# EAGLE design usb card (EAGLE 9.0.0)

## Sheet 1 of 5
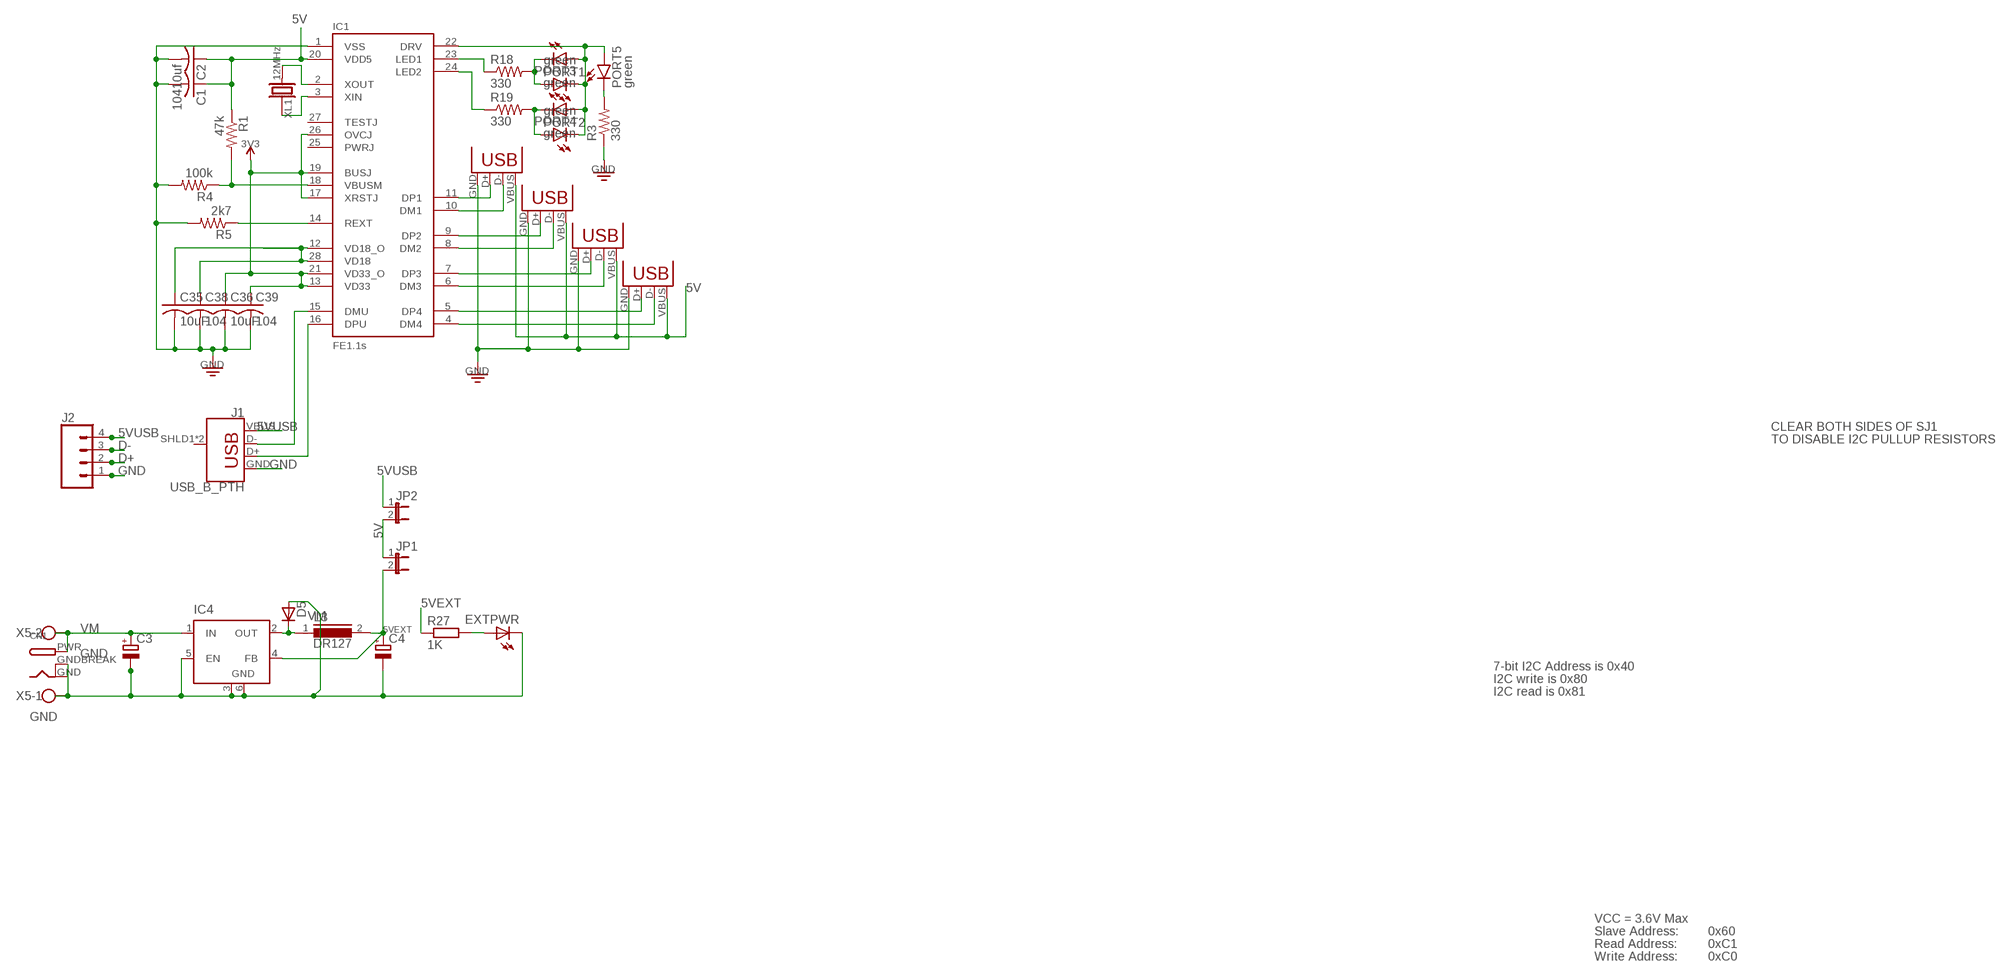
[diagram p0: schematic, sheet 1]

### Parts
C1  104  C-USC1206  [C1206]
C2  10uf  C-USC1206  [C1206]
C3  CPOL-EUE3.5-8  [E3,5-8]
C4  CPOL-EUE3.5-8  [E3,5-8]
C35  10uF  C-USC1206  [C1206]
C36  10uF  C-USC1206  [C1206]
C38  104  C-USC1206  [C1206]
C39  104  C-USC1206  [C1206]
CN1  DCBARRELPTH  [DCJACK_2MM_PTH]
D5  D-SOD-80  [SOD80]
EXTPWR  LEDCHIPLED_1206  [CHIPLED_1206]
IC1  FE1.1S  [FE1.1S_SSOP-28]
IC4  LM2596S  [TO263-5]
J1  USB_B_PTH  [USB-B-PTH]
J2  CONN_04  [1X04]
JP1  JP1E  [JP1]
JP2  JP1E  [JP1]
L3  DR127  [DR127]
PORT1  green  LED1206  [LED-1206]
PORT2  green  LED1206  [LED-1206]
PORT3  green  LED1206  [LED-1206]
PORT4  green  LED1206  [LED-1206]
PORT5  green  LED1206  [LED-1206]
R1  47k  R-US_R1206  [R1206]
R3  330  R-US_R1206  [R1206]
R4  100k  R-US_R1206  [R1206]
R5  2k7  R-US_R1206  [R1206]
R18  330  R-US_R1206  [R1206]
R19  330  R-US_R1206  [R1206]
R27  1K  R-EU_M1206  [M1206]
USB2  USBA-PTH  [USB-A-F-PTH]
USB3  USBA-PTH  [USB-A-F-PTH]
USB4  USBA-PTH  [USB-A-F-PTH]
USB5  USBA-PTH  [USB-A-F-PTH]
X5  W237-102  [W237-102]
XL1  12MHz  CRYSTALHC49S  [HC49S]

### Nets
3V3: C36.1 C39.1 IC1.13(VD33) IC1.17(XRSTJ) IC1.19(BUSJ) IC1.21(VD33_O) IC1.26(OVCJ)
5V: C1.1 C2.1 IC1.20(VDD5) JP1.1 JP2.2 R1.1 USB2.VBUS USB3.VBUS USB4.VBUS USB5.VBUS ; also sheet 2,3,4,5
5VEXT: C4.+ IC4.4(FB) JP1.2 L3.2 R27.1
5VUSB: J1.VBUS J2.4 JP2.1
D+: IC1.16(DPU) J1.D+ J2.2
D-: IC1.15(DMU) J1.D- J2.3
DM1: IC1.10(DM1) USB5.D- ; also sheet 2
DM2: IC1.8(DM2) USB4.D- ; also sheet 3
DM3: IC1.6(DM3) USB3.D- ; also sheet 4
DM4: IC1.4(DM4) USB2.D- ; also sheet 5
DP1: IC1.11(DP1) USB5.D+ ; also sheet 2
DP2: IC1.9(DP2) USB4.D+ ; also sheet 3
DP3: IC1.7(DP3) USB3.D+ ; also sheet 4
DP4: IC1.5(DP4) USB2.D+ ; also sheet 5
GND: C1.2 C2.2 C3.- C4.- C35.2 C36.2 C38.2 C39.2 CN1.GND CN1.GNDBREAK D5.2(A) EXTPWR.C IC1.1(VSS) IC4.3(GND) IC4.5(EN) IC4.6(GND) J1.GND J2.1 R3.1 R4.2 R5.2 USB2.GND USB3.GND USB4.GND USB5.GND X5.1 ; also sheet 2,3,4,5
N$1: IC1.14(REXT) R5.1
N$6: PORT2.C PORT4.A R19.2
N$7: IC1.2(XOUT) XL1.2
N$8: C35.1 C38.1 IC1.12(VD18_O) IC1.28(VD18)
N$9: IC1.3(XIN) XL1.1
N$13: IC1.18(VBUSM) R1.2 R4.1
N$20: PORT1.C PORT3.A R18.2
N$22: PORT5.C R3.2
N$23: IC1.23(LED1) R18.1
N$24: IC1.24(LED2) R19.1
N$25: IC1.22(DRV) PORT1.A PORT2.A PORT3.C PORT4.C PORT5.A
N$36: D5.1(C) IC4.2(OUT) L3.1
N$37: EXTPWR.A R27.2
VM: C3.+ CN1.PWR IC4.1(IN) X5.2
Unconnected: IC1.25(PWRJ) IC1.27(TESTJ) J1.SHLD1(SHIELD) J1.SHLD2(SHIELD)

### Notes on the sheet
- CLEAR BOTH SIDES OF SJ1
- TO DISABLE I2C PULLUP RESISTORS
- 7-bit I2C Address is 0x40
- I2C write is 0x80
- I2C read is 0x81
- VCC = 3.6V Max
- Slave Address: | 0x60
- Read Address: | 0xC1
- Write Address: | 0xC0

## Sheet 2 of 5
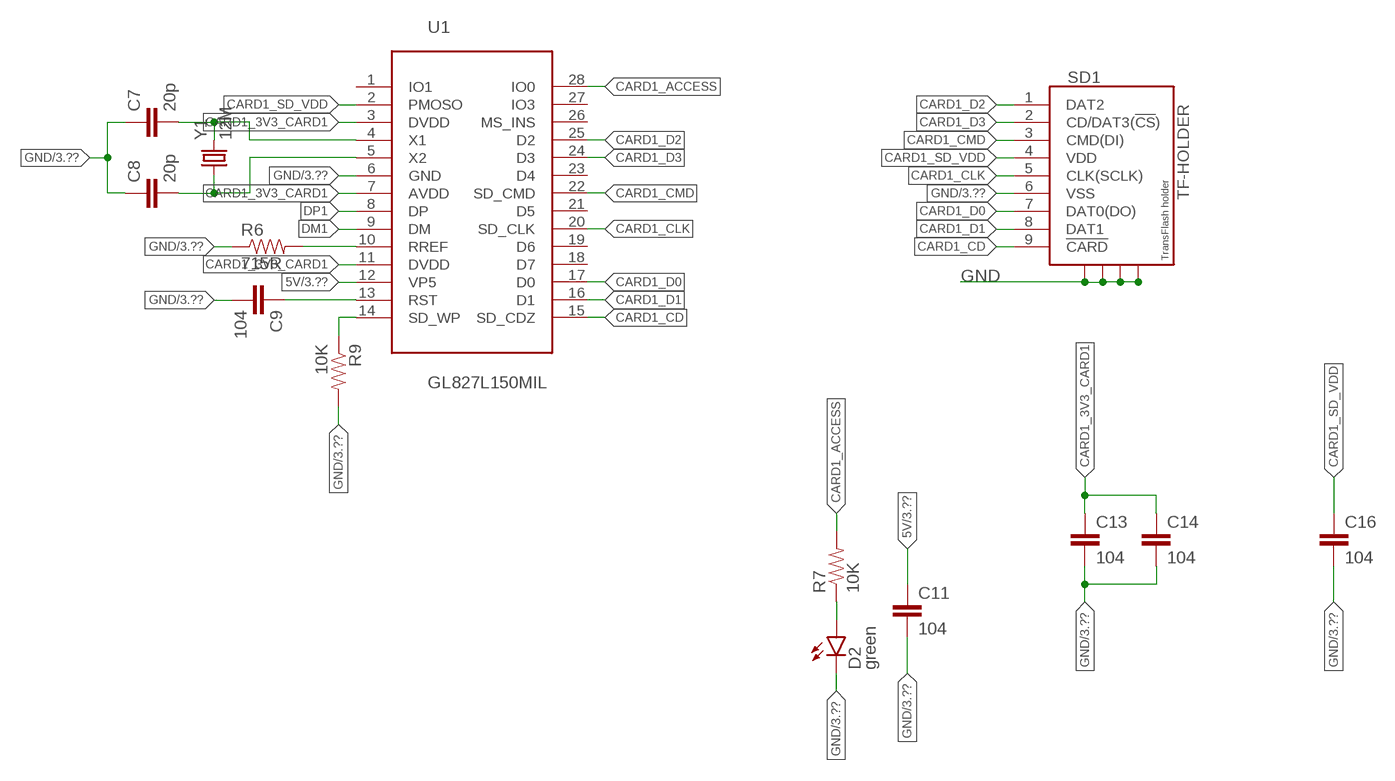
[diagram p1: schematic, sheet 2]

### Parts
C7  20p  CAP1206  [1206]
C8  20p  CAP1206  [1206]
C9  104  CAP1206  [1206]
C11  104  CAP1206  [1206]
C13  104  CAP1206  [1206]
C14  104  CAP1206  [1206]
C16  104  CAP1206  [1206]
D2  green  LED1206  [LED-1206]
R6  715R  RESISTOR1206  [1206]
R7  10K  RESISTOR1206  [1206]
R9  10K  RESISTOR1206  [1206]
SD1  TF-HOLDER  [TF-PULL]
U1  GL827L150MIL  [SSOP28-39]
Y1  12M  CRYSTAL2HC49US  [HC49US]

### Nets
5V: C11.1 U1.12(VP5) ; also sheet 1,3,4,5
CARD1_3V3_CARD1: C13.1 C14.1 U1.3(DVDD) U1.7(AVDD) U1.11(DVDD)
CARD1_ACCESS: R7.2 U1.28(IO0)
CARD1_CD: SD1.9(!CARD) U1.15(SD_CDZ)
CARD1_CLK: SD1.5(CLK(SCLK)) U1.20(SD_CLK)
CARD1_CMD: SD1.3(CMD(DI)) U1.22(SD_CMD)
CARD1_D0: SD1.7(DAT0(DO)) U1.17(D0)
CARD1_D1: SD1.8(DAT1) U1.16(D1)
CARD1_D2: SD1.1(DAT2) U1.25(D2)
CARD1_D3: SD1.2(CD/DAT3(!CS!)) U1.24(D3)
CARD1_SD_VDD: C16.1 SD1.4(VDD) U1.2(PMOSO)
DM1: U1.9(DM) ; also sheet 1
DP1: U1.8(DP) ; also sheet 1
GND: C7.1 C8.1 C9.2 C11.2 C13.2 C14.2 C16.2 D2.C R6.1 R9.2 SD1.6(VSS) SD1.S1 SD1.S2 SD1.S3 SD1.S4 U1.6(GND) ; also sheet 1,3,4,5
N$2: C7.2 U1.4(X1) Y1.2
N$5: C8.2 U1.5(X2) Y1.1
N$10: R6.2 U1.10(RREF)
N$21: C9.1 U1.13(RST)
N$26: D2.A R7.1
N$28: R9.1 U1.14(SD_WP)
Unconnected: U1.1(IO1) U1.18(D7) U1.19(D6) U1.21(D5) U1.23(D4) U1.26(MS_INS) U1.27(IO3)

## Sheet 3 of 5
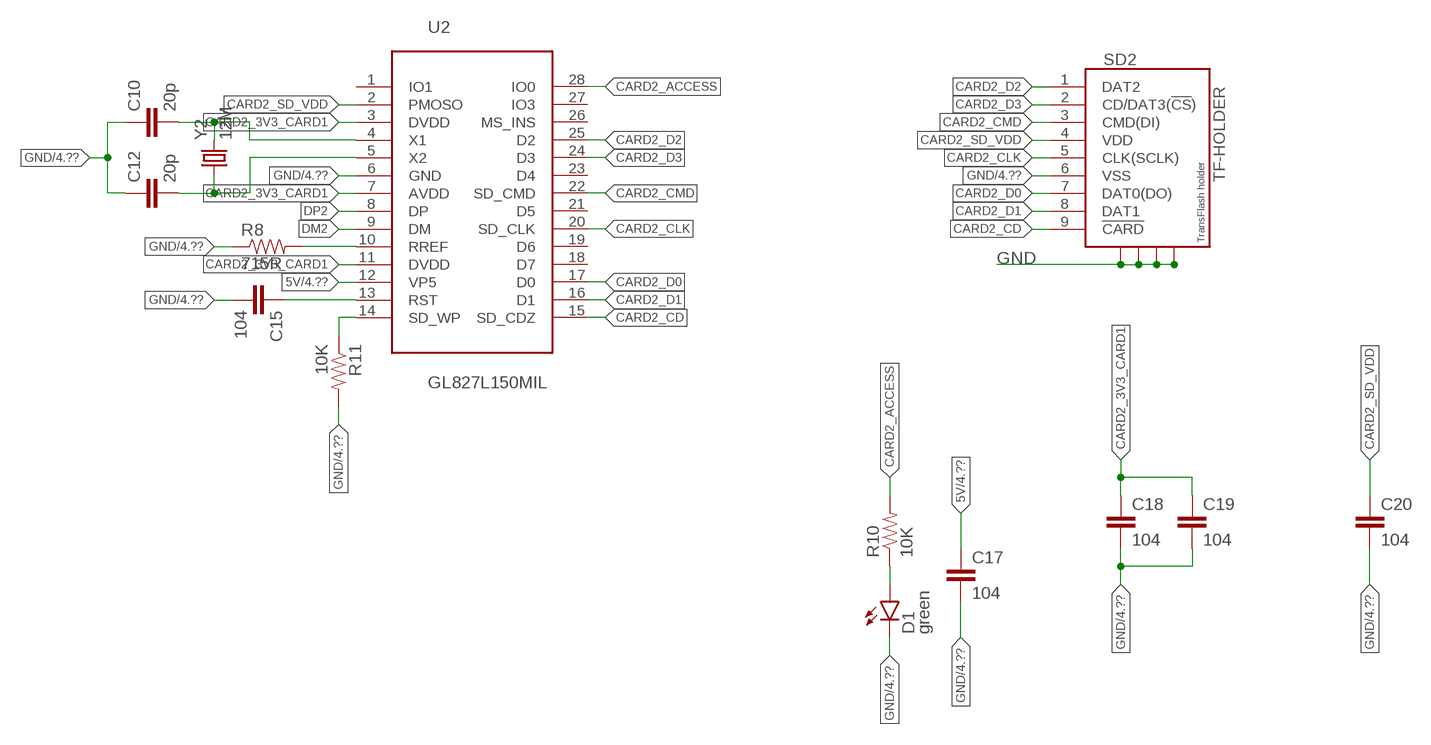
[diagram p2: schematic, sheet 3]

### Parts
C10  20p  CAP1206  [1206]
C12  20p  CAP1206  [1206]
C15  104  CAP1206  [1206]
C17  104  CAP1206  [1206]
C18  104  CAP1206  [1206]
C19  104  CAP1206  [1206]
C20  104  CAP1206  [1206]
D1  green  LED1206  [LED-1206]
R8  715R  RESISTOR1206  [1206]
R10  10K  RESISTOR1206  [1206]
R11  10K  RESISTOR1206  [1206]
SD2  TF-HOLDER  [TF-PULL]
U2  GL827L150MIL  [SSOP28-39]
Y2  12M  CRYSTAL2HC49US  [HC49US]

### Nets
5V: C17.1 U2.12(VP5) ; also sheet 1,2,4,5
CARD2_3V3_CARD1: C18.1 C19.1 U2.3(DVDD) U2.7(AVDD) U2.11(DVDD)
CARD2_ACCESS: R10.2 U2.28(IO0)
CARD2_CD: SD2.9(!CARD) U2.15(SD_CDZ)
CARD2_CLK: SD2.5(CLK(SCLK)) U2.20(SD_CLK)
CARD2_CMD: SD2.3(CMD(DI)) U2.22(SD_CMD)
CARD2_D0: SD2.7(DAT0(DO)) U2.17(D0)
CARD2_D1: SD2.8(DAT1) U2.16(D1)
CARD2_D2: SD2.1(DAT2) U2.25(D2)
CARD2_D3: SD2.2(CD/DAT3(!CS!)) U2.24(D3)
CARD2_SD_VDD: C20.1 SD2.4(VDD) U2.2(PMOSO)
DM2: U2.9(DM) ; also sheet 1
DP2: U2.8(DP) ; also sheet 1
GND: C10.1 C12.1 C15.2 C17.2 C18.2 C19.2 C20.2 D1.C R8.1 R11.2 SD2.6(VSS) SD2.S1 SD2.S2 SD2.S3 SD2.S4 U2.6(GND) ; also sheet 1,2,4,5
N$3: C10.2 U2.4(X1) Y2.2
N$4: C12.2 U2.5(X2) Y2.1
N$11: R8.2 U2.10(RREF)
N$12: C15.1 U2.13(RST)
N$14: D1.A R10.1
N$15: R11.1 U2.14(SD_WP)
Unconnected: U2.1(IO1) U2.18(D7) U2.19(D6) U2.21(D5) U2.23(D4) U2.26(MS_INS) U2.27(IO3)

## Sheet 4 of 5
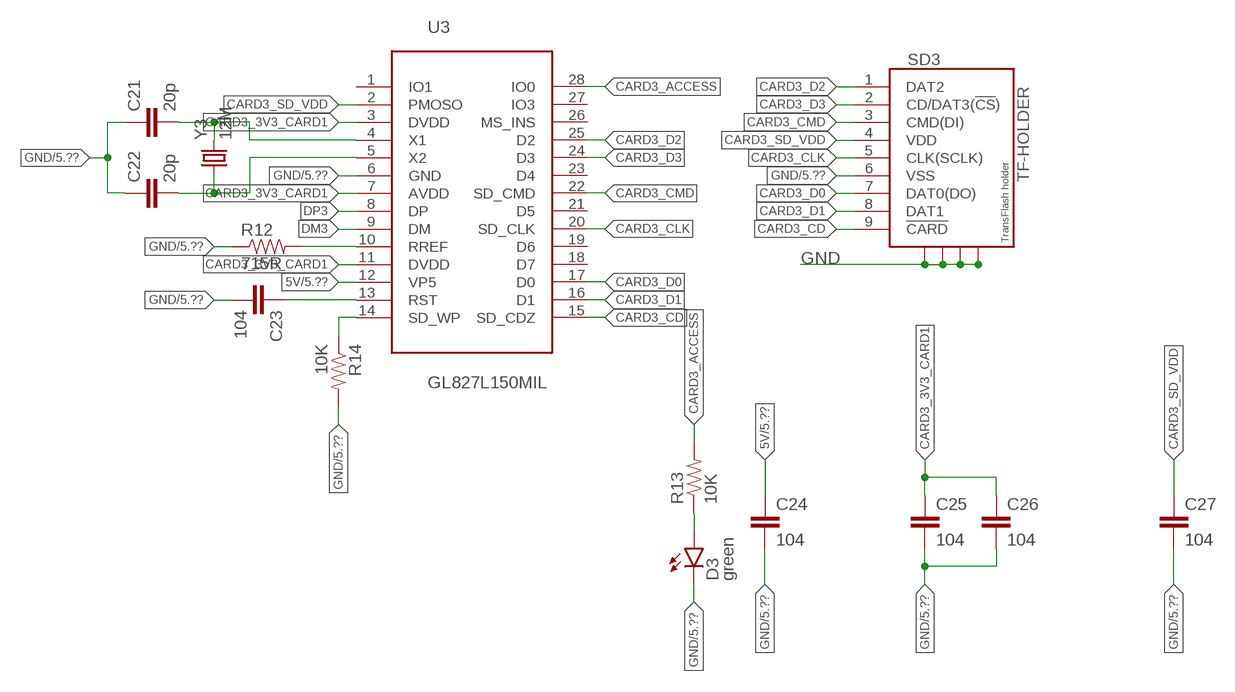
[diagram p3: schematic, sheet 4]

### Parts
C21  20p  CAP1206  [1206]
C22  20p  CAP1206  [1206]
C23  104  CAP1206  [1206]
C24  104  CAP1206  [1206]
C25  104  CAP1206  [1206]
C26  104  CAP1206  [1206]
C27  104  CAP1206  [1206]
D3  green  LED1206  [LED-1206]
R12  715R  RESISTOR1206  [1206]
R13  10K  RESISTOR1206  [1206]
R14  10K  RESISTOR1206  [1206]
SD3  TF-HOLDER  [TF-PULL]
U3  GL827L150MIL  [SSOP28-39]
Y3  12M  CRYSTAL2HC49US  [HC49US]

### Nets
5V: C24.1 U3.12(VP5) ; also sheet 1,2,3,5
CARD3_3V3_CARD1: C25.1 C26.1 U3.3(DVDD) U3.7(AVDD) U3.11(DVDD)
CARD3_ACCESS: R13.2 U3.28(IO0)
CARD3_CD: SD3.9(!CARD) U3.15(SD_CDZ)
CARD3_CLK: SD3.5(CLK(SCLK)) U3.20(SD_CLK)
CARD3_CMD: SD3.3(CMD(DI)) U3.22(SD_CMD)
CARD3_D0: SD3.7(DAT0(DO)) U3.17(D0)
CARD3_D1: SD3.8(DAT1) U3.16(D1)
CARD3_D2: SD3.1(DAT2) U3.25(D2)
CARD3_D3: SD3.2(CD/DAT3(!CS!)) U3.24(D3)
CARD3_SD_VDD: C27.1 SD3.4(VDD) U3.2(PMOSO)
DM3: U3.9(DM) ; also sheet 1
DP3: U3.8(DP) ; also sheet 1
GND: C21.1 C22.1 C23.2 C24.2 C25.2 C26.2 C27.2 D3.C R12.1 R14.2 SD3.6(VSS) SD3.S1 SD3.S2 SD3.S3 SD3.S4 U3.6(GND) ; also sheet 1,2,3,5
N$16: C21.2 U3.4(X1) Y3.2
N$17: C22.2 U3.5(X2) Y3.1
N$18: R12.2 U3.10(RREF)
N$19: C23.1 U3.13(RST)
N$27: D3.A R13.1
N$29: R14.1 U3.14(SD_WP)
Unconnected: U3.1(IO1) U3.18(D7) U3.19(D6) U3.21(D5) U3.23(D4) U3.26(MS_INS) U3.27(IO3)

## Sheet 5 of 5
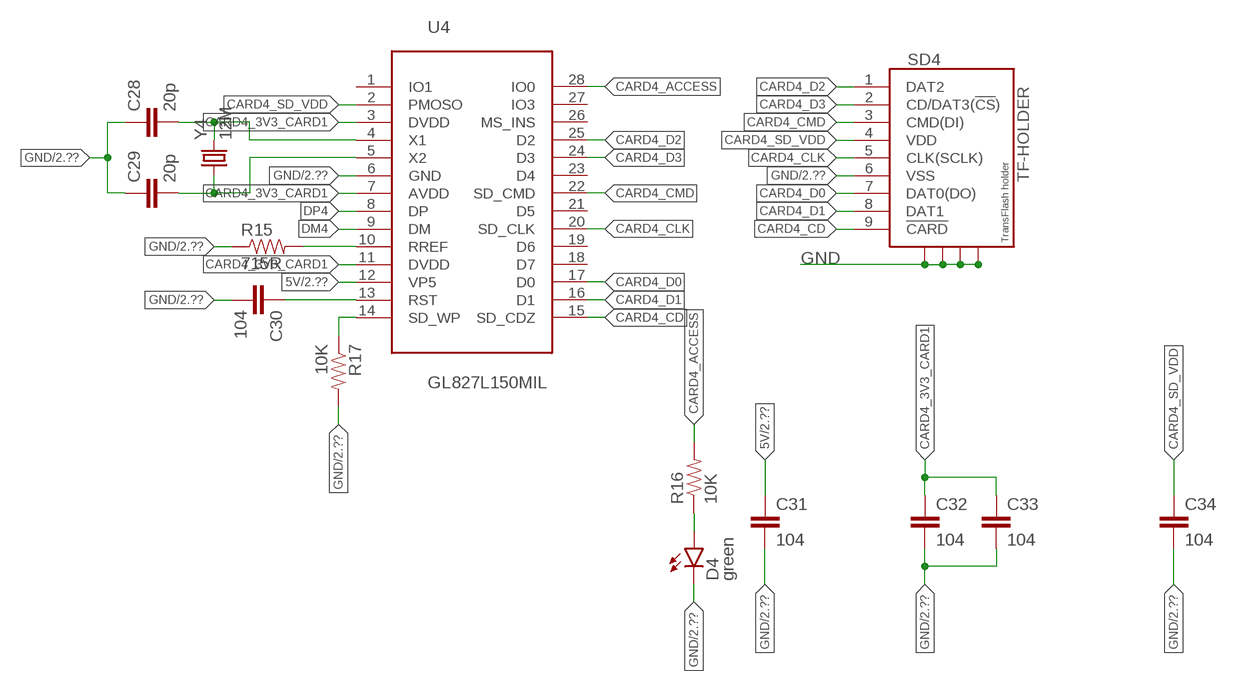
[diagram p4: schematic, sheet 5]

### Parts
C28  20p  CAP1206  [1206]
C29  20p  CAP1206  [1206]
C30  104  CAP1206  [1206]
C31  104  CAP1206  [1206]
C32  104  CAP1206  [1206]
C33  104  CAP1206  [1206]
C34  104  CAP1206  [1206]
D4  green  LED1206  [LED-1206]
R15  715R  RESISTOR1206  [1206]
R16  10K  RESISTOR1206  [1206]
R17  10K  RESISTOR1206  [1206]
SD4  TF-HOLDER  [TF-PULL]
U4  GL827L150MIL  [SSOP28-39]
Y4  12M  CRYSTAL2HC49US  [HC49US]

### Nets
5V: C31.1 U4.12(VP5) ; also sheet 1,2,3,4
CARD4_3V3_CARD1: C32.1 C33.1 U4.3(DVDD) U4.7(AVDD) U4.11(DVDD)
CARD4_ACCESS: R16.2 U4.28(IO0)
CARD4_CD: SD4.9(!CARD) U4.15(SD_CDZ)
CARD4_CLK: SD4.5(CLK(SCLK)) U4.20(SD_CLK)
CARD4_CMD: SD4.3(CMD(DI)) U4.22(SD_CMD)
CARD4_D0: SD4.7(DAT0(DO)) U4.17(D0)
CARD4_D1: SD4.8(DAT1) U4.16(D1)
CARD4_D2: SD4.1(DAT2) U4.25(D2)
CARD4_D3: SD4.2(CD/DAT3(!CS!)) U4.24(D3)
CARD4_SD_VDD: C34.1 SD4.4(VDD) U4.2(PMOSO)
DM4: U4.9(DM) ; also sheet 1
DP4: U4.8(DP) ; also sheet 1
GND: C28.1 C29.1 C30.2 C31.2 C32.2 C33.2 C34.2 D4.C R15.1 R17.2 SD4.6(VSS) SD4.S1 SD4.S2 SD4.S3 SD4.S4 U4.6(GND) ; also sheet 1,2,3,4
N$30: C28.2 U4.4(X1) Y4.2
N$31: C29.2 U4.5(X2) Y4.1
N$32: R15.2 U4.10(RREF)
N$33: C30.1 U4.13(RST)
N$34: D4.A R16.1
N$35: R17.1 U4.14(SD_WP)
Unconnected: U4.1(IO1) U4.18(D7) U4.19(D6) U4.21(D5) U4.23(D4) U4.26(MS_INS) U4.27(IO3)

## Library data of the parts
C1 C2 C35 C36 C38 C39 = adafruit:C-US: CAPACITOR, American symbol
C3 C4 = resistor:CPOL-EU: POLARIZED CAPACITOR, European symbol
C7-C34 = z_jlc_smt:CAP: Capacitor Standard 0603 ceramic capacitor, and 0.1" leaded capacitor.
CN1 = adafruit:DCBARREL: 2.0mm DC Barrel Jack DCJACK_2MM_PTH - Through Hole Jack (4UConnector: 05537)
D1-D4 PORT1-PORT5 = z_jlc_smt:LED: LEDs Standard schematic elements and footprints for 5mm, 3mm, 1206, and 0603 sized LEDs. 5mm - Spark Fun Electronics SKU : COM-00529 (and others)
D5 = semicon-smd-ipc:D-: DIODE unfilled
EXTPWR = RepRapjr:LED: LED OSRAM: - CHIPLED LG R971, LG N971, LY N971, LG Q971, LY Q971, LO R971, LY R971 LH N974, LH R974 LS Q976, LO Q976, LY Q976 LO Q996 - Hyper CHIPLED LW Q18S LB Q993, LB Q99A, LB R99A - SideLED LS A670, LO A670, LY A670, LG A670, LP A670 LB A673, LV A673, LT A673, LW A673 LH A674 LY A675 LS A676, LA A676, LO A676, LY A676, LW A676 LS A679, LY A679, LG A679 - Hyper Micro SIDELED® LS Y876, LA Y876, LO Y876, LY Y876 LT Y87S - SmartLED LW L88C, LW L88S LB L89C, LB L89S, LG L890 LS L89K, LO L89K, LY L89K LS L896, LA L896, LO L896, LY L896 - TOPLED LS T670, LO T670, LY T670, LG T670, LP T670 LSG T670, LSP T670, LSY T670, LOP T670, LYG T670 LG T671, LOG T671, LSG T671 LB T673, LV T673, LT T673, LW T673 LH T674 LS T676, LA T676, LO T676, LY T676, LB T676, LH T676, LSB T676, LW T676 LB T67C, LV T67C, LT T67C, LS T67K, LO T67K, LY T67K, LW E67C LS E67B, LA E67B, LO E67B, LY E67B, LB E67C, LV E67C, LT E67C LW T67C LS T679, LY T679, LG T679 LS T770, LO T770, LY T770, LG T770, LP T770 LB T773, LV T773, LT T773, LW T773 LH T774 LS E675, LA E675, LY E675, LS T675 LS T776, LA T776, LO T776, LY T776, LB T776 LHGB T686 LT T68C, LB T68C - Hyper Mini TOPLED® LB M676 - Mini TOPLED Santana® LG M470 LS M47K, LO M47K, LY M47K Source: http://www.osram.convergy.de LUXEON: - LUMILED® LXK2-PW12-R00, LXK2-PW12-S00, LXK2-PW14-U00, LXK2-PW14-V00 LXK2-PM12-R00, LXK2-PM12-S00, LXK2-PM14-U00 LXK2-PE12-Q00, LXK2-PE12-R00, LXK2-PE12-S00, LXK2-PE14-T00, LXK2-PE14-U00 LXK2-PB12-K00, LXK2-PB12-L00, LXK2-PB12-M00, LXK2-PB14-N00, LXK2-PB14-P00, LXK2-PB14-Q00 LXK2-PR12-L00, LXK2-PR12-M00, LXK2-PR14-Q00, LXK2-PR14-R00 LXK2-PD12-Q00, LXK2-PD12-R00, LXK2-PD12-S00 LXK2-PH12-R00, LXK2-PH12-S00 LXK2-PL12-P00, LXK2-PL12-Q00, LXK2-PL12-R00 Source: www.luxeon.com KINGBRIGHT: KA-3528ASYC Source: www.kingbright.com
IC1 = Ai_IC:FE1.1S
IC4 = linear:LM2596S: STEP-DOWN VOLTAGE REGULATOR
J1 = SparkFun-Connectors:USB_B: USB Type B Connector SparkFun Products: SparkFun Stepoko <https://www.sparkfun.com/products/13899> PTH; PROD_ID: CONN-08278; SF_ID: PRT-00139
J2 = SparkFun-Connectors:CONN_04: Multi connection point. Often used as Generic Header-pin footprint for 0.1 inch spaced/style header connections On any of the 0.1 inch spaced packages, you can populate with these: Break Away Headers - Straight <https://www.sparkfun.com/products/116> (PRT-00116) Break Away Male Headers - Right Angle <https://www.sparkfun.com/products/553> (PRT-00553) Female Headers <https://www.sparkfun.com/products/115> (PRT-00115) Break Away Headers - Machine Pin <https://www.sparkfun.com/products/117> (PRT-00117) Break Away Female Headers - Swiss Machine Pin <https://www.sparkfun.com/products/743> (PRT-00743) For SCREWTERMINALS and SPRING TERMINALS visit here: Screw Terimnals on SparkFun.com <https://www.sparkfun.com/search/results?term=Screw+Terminals> (5mm/3.5mm/2.54mm spacing) This device is also useful as a general connection point to wire up your design to another part of your project. Our various solder wires solder well into these plated through hole pads. Hook-Up Wire - Assortment (Stranded, 22 AWG) <https://www.sparkfun.com/products/11375> (PRT-11375) Hook-Up Wire - Assortment (Solid Core, 22 AWG) <https://www.sparkfun.com/products/11367> (PRT-11367) View the entire wire category on our website here <https://www.sparkfun.com/categories/141> Special notes: Molex polarized connector foot print use with SKU : PRT-08231 with associated crimp pins and housings. 1MM SMD Version SKU: PRT-10208; PROD_ID: CONN-09696
JP1 JP2 = jumper:JP1E: JUMPER
L3 = inductors:DR127: High Power Density, High Efficiency, Shielded Inductors Source: coiltronics_dr_series.pdf
R1 R3-R5 R18 R19 = adafruit:R-US_: RESISTOR, American symbol
R6-R17 = z_jlc_smt:RESISTOR: Resistor Basic schematic elements and footprints for 0603, 1206, and PTH resistors.
R27 = rcl:R-EU_: RESISTOR, European symbol
SD1-SD4 = sd-mmc:TF-HOLDER: TF / Micro SD socket is PUSH-PUSH type, the card can be pushed into and auto locked and pushed out by simply press the card. Surface Mounting type.
U1-U4 = xmgu2008:GL827L
USB2-USB5 = Ai_Connectors:USB
X5 = con-wago-500:W237-102: WAGO SCREW CLAMP; MPN: 237-102; OC_FARNELL: unknown; OC_NEWARK: 70K9898
XL1 = Ai_FrequencyControl:CRYSTAL: PTH: ... SMD: ... Cylinder: CMR200T-32.768KDZBT
Y1-Y4 = xmgu2008:CRYSTAL2: Various standard crystals. Proven footprints.

## Net classes
1 power: width 0.381 mm, clearance 0.254 mm

## Board
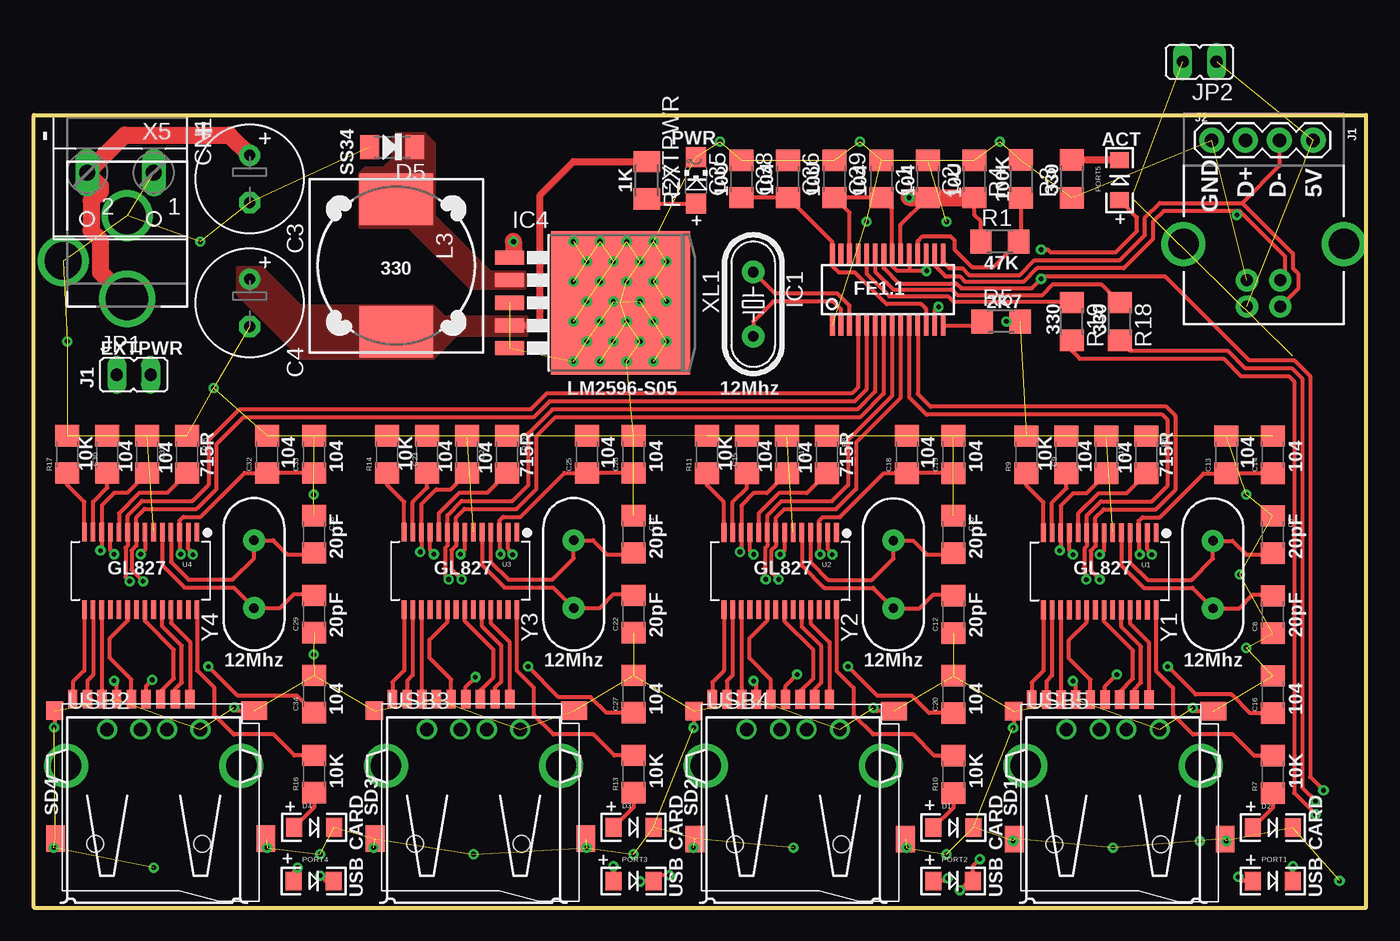
[diagram p5: board, top side]
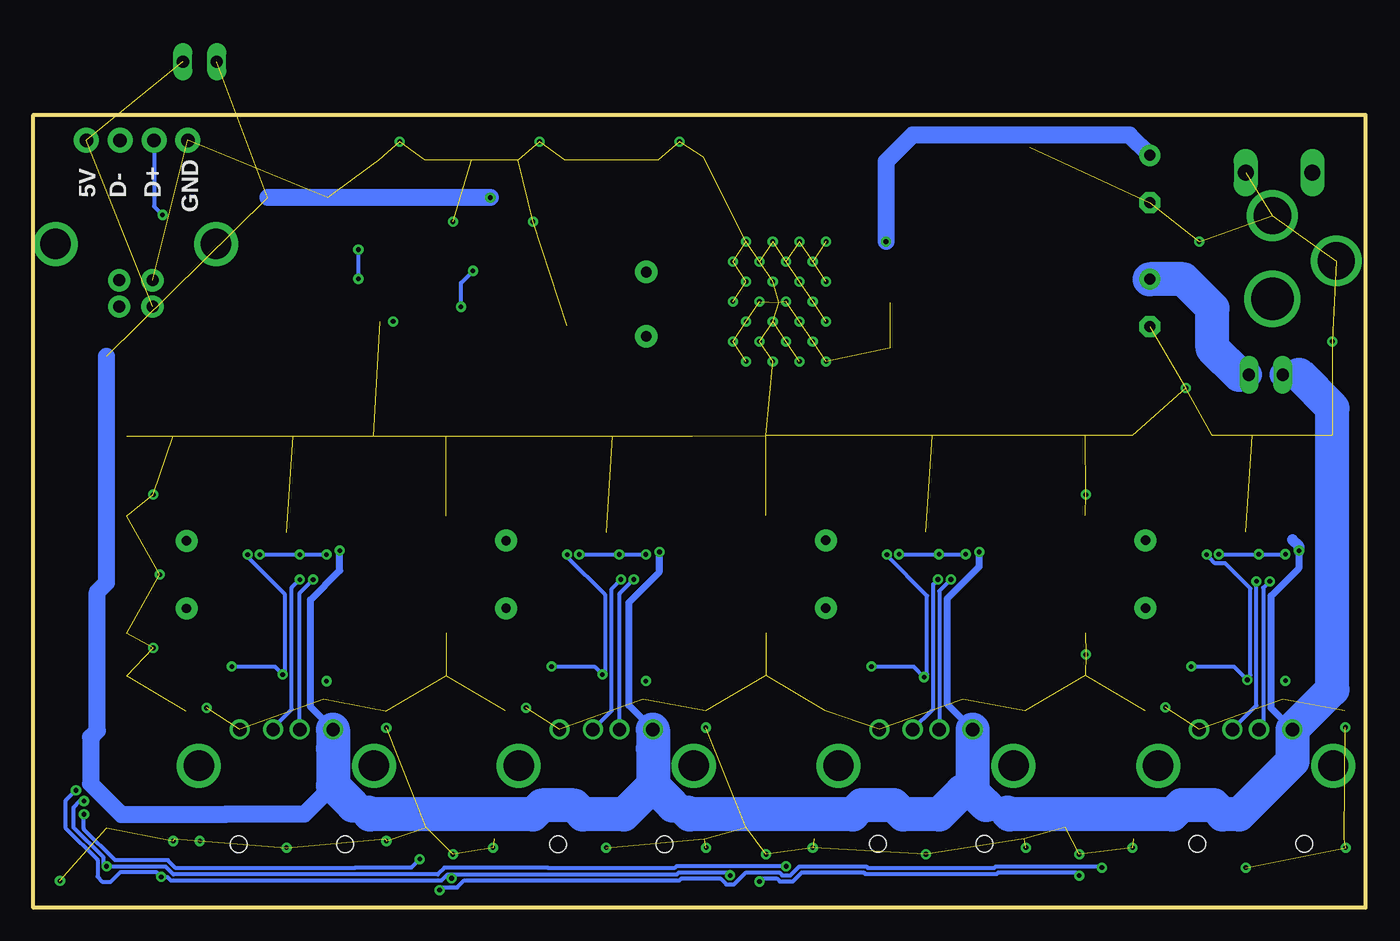
[diagram p6: board, bottom side, seen from below]

Size 100 x 59.5 mm. Coordinates in mm from the lower left corner, seen from the top.
Outline: 0,0 100,0 100,59.5 0,59.5 0,0
Copper layers (1*16): Top 0.035mm / dielectric 1.5mm / Bottom 0.035mm
Design rules "default *": minimum track width 6mil, minimum drill 0.35mm, track to track 6mil, track to pad 6mil, pad to pad 6mil, via to via 6mil, smd to smd 6mil, copper to edge 40mil, drill to drill 6mil, minimum pad ring 10mil, minimum via ring 8mil, stop-mask expansion 4mil, vias tented up to drill 20mil, thermal gap 10mil

### Footprints (pad centres in the part's own frame; a part is rotated, then mirrored left to right if it is on the bottom)
C1206 = smd 1.6 x 1.8: 1 -1.4,0; 2 1.4,0
E3,5-8 = drill 0.813 pad 1.6: + -1.778,0 | drill 0.813 pad 1.6 octagon: - 1.778,0
1206 = smd 1.6 x 1.8: 1 -1.4,0; 2 1.4,0
DCJACK_2MM_PTH = drill 2.8: GND 0,7.35; GNDBREAK 4.8,10.75 | drill 3.2: PWR 0,13.6
LED-1206 = smd 1.2 x 1.4: A -1.5,0; C 1.5,0
SOD80 = smd 1.4 x 1.8: 1 -1.7,0; 2 1.7,0
CHIPLED_1206 = smd 1.5 x 1.5: A 0,-1.75; C 0,1.75
FE1.1S_SSOP-28 = smd 0.35 x 1.5: 1 -4.16,-2.7; 2 -3.52,-2.7; 3 -2.88,-2.7; 4 -2.24,-2.7; 5 -1.6,-2.7; 6 -0.96,-2.7; 7 -0.32,-2.7; 8 0.32,-2.7; 9 0.96,-2.7; 10 1.6,-2.7; 11 2.24,-2.7; 12 2.88,-2.7; 13 3.52,-2.7; 14 4.16,-2.7; 15 4.16,2.7; 16 3.52,2.7; 17 2.88,2.7; 18 2.24,2.7; 19 1.6,2.7; 20 0.96,2.7; 21 0.32,2.7; 22 -0.3,2.7; 23 -0.96,2.7; 24 -1.6,2.7; 25 -2.24,2.7; 26 -2.88,2.7; 27 -3.52,2.7; 28 -4.16,2.7
TO263-5 = smd 1.067 x 2.159: 1 -3.404,-5.791; 2 -1.702,-5.791; 3 0,-5.791; 4 1.702,-5.791; 5 3.404,-5.791 | smd 10.8 x 10.41: 6 0,2.54
USB-B-PTH = drill 0.914 pad 1.676: D+ 4,1.25; D- 5.981,1.25; GND 4,-1.25; VBUS 5.981,-1.25 | drill 2.286: SHLD1 1.282,-6.02; SHLD2 1.282,6.02
1X04 = drill 1.016 pad 1.88: 1 0,0; 2 2.54,0; 3 5.08,0; 4 7.62,0
JP1 = drill 0.914 long: 1 0,-1.27; 2 0,1.27
DR127 = smd 3.85 x 5.5: 1 -4.975,0; 2 4.975,0
R1206 = smd 1.6 x 1.803: 1 -1.422,0; 2 1.422,0
M1206 = smd 1.6 x 2: 1 -1.4,0; 2 1.4,0
TF-PULL = smd 0.7 x 1.4: 1 -2.2,-7.62; 2 -1.1,-7.62; 3 0,-7.62; 4 1.1,-7.62; 5 2.2,-7.62; 6 3.3,-7.62; 7 4.4,-7.62; 8 5.5,-7.62; 9 6.6,-7.62 | smd 1.4 x 2: S1 -7.9,2.85; S2 7.9,2.85 | smd 1.28 x 1.4: S3 7.96,-6.75 | smd 1.95 x 1.4: S4 -7.025,-6.75 | hole 1.25: -3.1,3.25; 4.9,3.25
SSOP28-39 = smd 0.348 x 1.397: 1 -4.225,-3.656; 2 -3.575,-3.656; 3 -2.925,-3.656; 4 -2.275,-3.656; 5 -1.625,-3.656; 6 -0.975,-3.656; 7 -0.325,-3.656; 8 0.325,-3.656; 9 0.975,-3.656; 10 1.625,-3.656; 11 2.275,-3.656; 12 2.925,-3.656; 13 3.575,-3.656; 14 4.225,-3.656; 15 4.225,2.156; 16 3.575,2.156; 17 2.925,2.156; 18 2.275,2.156; 19 1.625,2.156; 20 0.975,2.156; 21 0.325,2.156; 22 -0.325,2.156; 23 -0.975,2.156; 24 -1.625,2.156; 25 -2.275,2.156; 26 -2.925,2.156; 27 -3.575,2.156; 28 -4.225,2.156
USB-A-F-PTH = drill 1: D+ 1,5.37; D- -1,5.37; GND 3.5,5.37; VBUS -3.5,5.37 | drill 2.286: P$1 -6.57,2.66; P$2 6.57,2.66
W237-102 = drill 1.194 long: 1 -2.5,-1.27; 2 2.5,-1.27
HC49S = drill 0.813 pad 1.676: 1 -2.413,0; 2 2.413,0
HC49US = drill 0.7 pad 1.651: 1 -2.54,0; 2 2.54,0

### Placement (x,y rotation side)
C1  67.1,54.7 90 top
C2  70.6,54.7 90 top
C3  16.2,54.7 270 top
C4  16.2,45.4 270 top
C7  93,28 270 top
C8  93,22 90 top
C9  77.5,34 90 top
C10  69.02,28.01 270 top
C11  80.5,34 90 top
C12  69.02,22.01 90 top
C13  89.5,34 90 top
C14  93,34 90 top
C15  53.52,34.01 90 top
C16  93,16 90 top
C17  56.52,34.01 90 top
C18  65.52,34.01 90 top
C19  69.02,34.01 90 top
C20  69.02,16.01 90 top
C21  45.02,28.03 270 top
C22  45.02,22.03 90 top
C23  29.52,34.03 90 top
C24  32.52,34.03 90 top
C25  41.52,34.03 90 top
C26  45.02,34.03 90 top
C27  45.02,16.03 90 top
C28  21.02,28.03 270 top
C29  21.02,22.03 90 top
C30  5.52,34.03 90 top
C31  8.52,34.03 90 top
C32  17.52,34.03 90 top
C33  21.02,34.03 90 top
C34  21.02,16.03 90 top
C35  53.1,54.7 90 top
C36  60.1,54.7 90 top
C38  56.6,54.7 90 top
C39  63.6,54.7 90 top
CN1  7,59.3 180 top
D1  69.02,6.01 0 top
D2  93,6 0 top
D3  45.02,6.03 0 top
D4  21.02,6.03 0 top
D5  26.9,57.1 180 top
EXTPWR  49.7,54.6 0 top
IC1  64.1,46.4 0 top
IC4  41.5,45.4 270 top
J1  92.3,51.1 270 top
J2  88.4,57.6 0 top
JP1  7.5,40 270 top
JP2  87.5,63.5 90 top  (outside the outline)
L3  27.2,48.2 270 top
PORT1  93,2 0 top
PORT2  69,2 0 top
PORT3  45,2 0 top
PORT4  21,2 0 top
PORT5  81.5,54.6 90 top
R1  72.5,50 0 top
R3  77.9,54.7 90 top
R4  74.1,54.7 90 top
R5  72.6,44 0 top
R6  83.5,34 270 top
R7  93,10 90 top
R8  59.52,34.01 270 top
R9  74.5,34 90 top
R10  69.02,10.01 90 top
R11  50.52,34.01 90 top
R12  35.52,34.03 270 top
R13  45.02,10.03 90 top
R14  26.52,34.03 90 top
R15  11.52,34.03 270 top
R16  21.02,10.03 90 top
R17  2.52,34.03 90 top
R18  81.5,44 270 top
R19  77.9,44 270 top
R27  46,54.6 270 top
SD1  81.5,8 180 top
SD2  57.52,8.01 180 top
SD3  33.52,8.03 180 top
SD4  9.52,8.03 180 top
U1  80,24.5 180 top
U2  56.02,24.51 180 top
U3  32.02,24.53 180 top
U4  8.02,24.53 180 top
USB2  9,8 0 top
USB3  33,8 0 top
USB4  57,8 0 top
USB5  81,8 0 top
X5  6.5,53.9 180 top
XL1  54,45.3 270 top
Y1  88.5,25 90 top
Y2  64.52,25.01 90 top
Y3  40.52,25.03 90 top
Y4  16.52,25.03 90 top

### Tracks (layer width: path | path; a pad name or v marks a point on that pad's centre or on a via)
3V3  (via drill 0.35)
  Top 0.305: IC1.13 67.62,44.82 v67.9,45.1 | 65.7,47.8 v67,47.8 67,49.08 IC1.17 | 65.7,47.8 64.8,47.8 64.42,48.18 IC1.21 64.42,52.48 C39.1 C36.1 61.22,52.18 IC1.26 | IC1.19 65.7,47.8
  Bottom 0.305: v67.9,45.1 67.9,46.9 v67,47.8
5V  (via drill 0.35)  (2 unrouted)
  Top 0.305: C11.1 79,31.1 78,31.1 77.08,30.18 U1.12 77.08,26.88 v77,26.8 | C17.1 55.02,31.11 54.02,31.11 53.09,30.18 U2.12 53.09,26.8 v53,26.7 | C31.1 7.02,31.13 6.02,31.13 5.09,30.2 U4.12 5.09,26.89 v5,26.8 | v29,26.7 29.09,26.8 U3.12 29.09,30.3 30.2,31.4 31.29,31.4 C24.1 | IC1.20 65.06,51.26 66.95,53.15 C1.1 | R1.1 71.08,51.52 70.6,52 C2.1
  Top 1.27: C1.1 C2.1 | v65.7,53.3 66.8,53.3 66.95,53.15
  Bottom 0.508: USB2.VBUS 7.1,14.97 7.1,23.4 5,25.5 v5,26.8 | USB3.VBUS 31.4,15.27 31.4,23.2 29,25.6 v29,26.7 | USB4.VBUS 55.3,15.17 55.3,22.9 53,25.2 v53,26.7 | USB5.VBUS 79.2,15.07 79.2,23.1 77,25.3 v77,26.8
  Bottom 0.813: v5,26.8 5,27.1 5.5,27.6
  Bottom 1.27: 94.5,41.4 94.5,24.4 95.2,23.7 95.2,13.3 95.7,12.8 95.7,9.3 93.4,7 85.57,7 85.54,7.03 79.64,7.03 77.5,9.16 | v65.7,53.3 82.4,53.3 | 74.73,7 75.34,7 76,7.66 | 50.74,7 51.41,7.67 52,7.67 | 26.72,7 27.41,7.69 28.5,7.69
  Bottom 2: 5,40 JP1.1
  Bottom 2.54: 26.86,7.14 26.72,7 14.52,7 13.83,7.69 11.41,7.69 10.72,7 9.5,7 5.5,11 5.5,11.93 5.5,11.94 USB2.VBUS 2.5,16.37 2.5,37.5 5,40 | USB3.VBUS 29.5,11.94 29.5,11.93 29.5,8.69 | 28.5,7.69 29.5,8.69 | 29.5,8.69 30.31,8.69 32,7 34.72,7 35.41,7.69 37.83,7.69 38.52,7 50.74,7 50.87,7.13 | USB4.VBUS 53.5,11.94 53.5,11.93 53.5,9.17 | 52,7.67 53.5,9.17 | 53.5,9.17 55.68,7 58.74,7 59.41,7.67 61.83,7.67 62.5,7 74.73,7 74.87,7.13 | USB5.VBUS 77.5,11.94 77.5,11.93 77.5,9.16 76,7.66
5VEXT
  Top 0.508: IC4.4 37.7,43.7 38,44 38,53.5 40.5,56 R27.1
  Bottom 2: JP1.2 9.5,40
  Bottom 2.54: 9.5,40 11.5,42 11.5,45 13.68,47.18 C4.+
  pour Top (no thermals): 37,44.3 30.8,44.3 30,45.1 20,45.1 17.1,48 15.3,48 15.3,46.1 15.4,46 20.1,41.3 30,41.3 31.7,43 34.6,43 37,43
5VUSB  (2 unrouted)
CARD1_3V3_CARD1  (via drill 0.35)
  Top 0.305: v83,26.5 82.92,26.57 U1.3 82.92,29.02 83.2,29.3 84.5,29.3 87.8,32.6 C13.1 C14.1 | v78,26.5 77.72,26.77 U1.11 | U1.7 80.33,26.82 v80,26.5
  Bottom 0.305: v83,26.5 v80,26.5 v78,26.5
CARD1_ACCESS
  Top 0.305: U1.28 84.22,17.77 85.5,16.5 85.5,14.5 87,13 90,13 91.6,11.4 R7.2
CARD1_CD
  Top 0.305: U1.15 75.78,17.77 74.9,16.9 SD1.9
CARD1_CLK
  Top 0.305: SD1.5 79.3,17.1 77.7,18.7 77.7,20.1 79.03,21.43 U1.20
CARD1_CMD
  Top 0.305: U1.22 80.33,21.48 82.5,19.3 82.5,17.2 81.5,16.2 SD1.3
CARD1_D0
  Top 0.305: U1.17 77.08,15.64 SD1.7
CARD1_D1
  Top 0.305: U1.16 76.42,17.43 76,17 SD1.8
CARD1_D2
  Top 0.305: U1.25 82.28,21.32 83.7,19.9 SD1.1
CARD1_D3
  Top 0.305: U1.24 81.62,21.07 83.1,19.6 83.1,16.9 82.6,16.4 SD1.2
CARD1_SD_VDD  (via drill 0.35)
  Top 0.305: SD1.4 80.4,16.62 v81.28,17.5 | v83.91,26.5 83.68,26.73 83.68,26.78 83.58,26.89 U1.2 | C16.1 91.3,14.6 89.9,16 87.2,16 v85.1,18.1
  Bottom 0.305: v83.91,26.5 83.91,26.31 81.1,23.5 81.1,17.68 v81.28,17.5 81.88,18.1 v85.1,18.1
CARD2_3V3_CARD1  (via drill 0.35)
  Top 0.305: v59.02,26.51 58.95,26.59 U2.3 58.95,29.04 59.22,29.31 60.52,29.31 63.82,32.61 C18.1 C19.1 | v54.02,26.51 53.74,26.79 U2.11 | U2.7 56.34,26.84 v56.02,26.51
  Bottom 0.305: v59.02,26.51 v56.02,26.51 v54.02,26.51
CARD2_ACCESS
  Top 0.305: U2.28 60.24,17.79 61.52,16.51 61.52,14.48 63,13 66,13 67.59,11.41 R10.2
CARD2_CD
  Top 0.305: U2.15 51.8,17.79 50.92,16.91 SD2.9
CARD2_CLK
  Top 0.305: SD2.5 55.32,17.11 53.7,18.73 53.7,20.2 55.05,21.55 U2.20
CARD2_CMD
  Top 0.305: U2.22 56.34,21.48 58.5,19.33 58.5,17.2 57.52,16.22 SD2.3
CARD2_D0
  Top 0.305: U2.17 53.09,15.65 SD2.7
CARD2_D1
  Top 0.305: U2.16 52.45,17.43 52.02,17.01 SD2.8
CARD2_D2
  Top 0.305: U2.25 58.3,21.34 59.72,19.91 SD2.1
CARD2_D3
  Top 0.305: U2.24 57.65,21.09 59.1,19.63 59.1,16.9 58.62,16.42 SD2.2
CARD2_SD_VDD  (via drill 0.35)
  Top 0.305: SD2.4 56.42,16.64 v57.28,17.5 | v59.93,26.5 59.7,26.73 59.7,26.79 59.59,26.9 U2.2 | C20.1 67.19,14.61 65.9,15.9 63.3,15.9 v61.1,18.1
  Bottom 0.305: v59.93,26.5 59.93,26.33 57.06,23.46 57.06,17.73 v57.28,17.5 57.88,18.1 v61.1,18.1
CARD3_3V3_CARD1  (via drill 0.35)
  Top 0.305: v35.02,26.53 34.95,26.61 U3.3 34.95,29.05 35.22,29.33 36.52,29.33 39.82,32.63 C25.1 C26.1 | v30.02,26.53 29.75,26.8 U3.11 | U3.7 32.34,26.86 v32.02,26.53
  Bottom 0.305: v35.02,26.53 v32.02,26.53 v30.02,26.53
CARD3_ACCESS
  Top 0.305: U3.28 36.24,17.8 37.52,16.53 37.52,14.48 39,13 42,13 43.57,11.43 R13.2
CARD3_CD
  Top 0.305: U3.15 27.8,17.8 26.92,16.93 SD3.9
CARD3_CLK
  Top 0.305: SD3.5 31.32,17.13 29.7,18.75 29.7,20.1 31.05,21.45 U3.20
CARD3_CMD
  Top 0.305: U3.22 32.34,21.5 34.5,19.35 34.5,17.3 33.52,16.32 SD3.3
CARD3_D0
  Top 0.305: U3.17 29.09,15.68 SD3.7
CARD3_D1
  Top 0.305: U3.16 28.45,17.45 28.02,17.03 SD3.8
CARD3_D2
  Top 0.305: U3.25 34.3,21.36 35.72,19.93 SD3.1
CARD3_D3
  Top 0.305: U3.24 33.65,21.11 35.1,19.65 35.1,17 34.62,16.52 SD3.2
CARD3_SD_VDD  (via drill 0.35)
  Top 0.305: SD3.4 32.42,16.58 v33.14,17.3 | v35.93,26.5 35.7,26.73 35.7,26.81 35.59,26.92 U3.2 | C27.1 42.97,14.63 41.8,15.8 39.4,15.8 v37.1,18.1
  Bottom 0.305: v35.93,26.5 35.93,26.43 32.91,23.41 32.91,17.53 v33.14,17.3 33.94,18.1 v37.1,18.1
CARD4_3V3_CARD1  (via drill 0.35)
  Top 0.305: v11.02,26.53 10.95,26.61 U4.3 10.95,29.05 11.22,29.33 12.52,29.33 15.82,32.63 C32.1 C33.1 | v6.02,26.53 5.75,26.8 U4.11 | U4.7 8.35,26.86 v8.02,26.53
  Bottom 0.305: v11.02,26.53 v8.02,26.53 v6.02,26.53
CARD4_ACCESS
  Top 0.305: U4.28 12.24,17.8 13.52,16.53 13.52,14.48 15,13 18,13 19.57,11.43 R16.2
CARD4_CD
  Top 0.305: U4.15 3.79,17.8 2.92,16.93 SD4.9
CARD4_CLK
  Top 0.305: SD4.5 7.32,17.13 5.7,18.75 5.7,20.2 7.04,21.55 U4.20
CARD4_CMD
  Top 0.305: U4.22 8.35,21.5 10.5,19.35 10.5,17.2 9.52,16.22 SD4.3
CARD4_D0
  Top 0.305: U4.17 5.09,15.68 SD4.7
CARD4_D1
  Top 0.305: U4.16 4.45,17.45 4.02,17.03 SD4.8
CARD4_D2
  Top 0.305: U4.25 10.29,21.36 11.72,19.93 SD4.1
CARD4_D3
  Top 0.305: U4.24 9.64,21.11 11.1,19.65 11.1,16.9 10.62,16.42 SD4.2
CARD4_SD_VDD  (via drill 0.35)
  Top 0.305: SD4.4 8.42,16.64 v8.88,17.1 | v11.93,26.5 11.7,26.73 11.7,26.81 11.6,26.92 U4.2 | C34.1 19.75,15.9 15.3,15.9 v13.1,18.1
  Bottom 0.305: v11.93,26.5 11.7,26.27 11.7,26.25 11.3,25.85 10.55,25.85 8.66,23.96 8.66,17.44 8.88,17.22 v8.88,17.1 9.88,18.1 v13.1,18.1
D+  (via drill 0.35)
  Top 0.305: IC1.16 67.62,48.18 68.4,47.4 69.5,47.4 69.9,47 74.3,47 75.3,48 81.8,48 84,50.2 84,51.5 84.8,52.3 90.4,52.3 | J1.D+ 93.9,47.45 93.9,48.9 90.5,52.3 90.4,52.3 | v90.3,52 90.4,52.1 90.4,52.3
  Bottom 0.305: J2.2 90.94,52.64 v90.3,52
D-
  Top 0.305: IC1.15 68.26,48.44 68.7,48 69.7,48 70.2,47.5 74,47.5 75.1,48.6 81.5,48.6 83.4,50.5 83.4,51.8 84.5,52.9 90.7,52.9 | 90.7,52.9 94.5,49.1 94.5,48 94.9,47.6 94.9,46.47 J1.D- | J2.3 93.48,55.68 90.7,52.9
DM1  (via drill 0.35)
  Top 0.305: v79,24.63 79.03,24.65 79.03,24.95 78.86,25.12 78.86,26.97 79.03,27.14 U1.9 79.03,29.43 80.1,30.5 83.9,30.5 85.1,31.7 85.1,36.6 84.7,37 67,37 65.7,38.3 IC1.10
  Bottom 0.305: USB5.D- 80,23.63 v79,24.63
DM2  (via drill 0.35)
  Top 0.305: v54.93,24.64 55.05,24.75 55.05,24.84 54.88,25.01 54.88,26.98 55.05,27.15 U2.9 55.05,29.43 56.12,30.51 59.92,30.51 61.12,31.71 61.12,35.12 64.42,38.42 IC1.8
  Bottom 0.305: USB4.D- 56,23.57 v54.93,24.64
DM3  (via drill 0.35)
  Top 0.305: v31.14,24.64 30.88,24.89 30.88,27 31.05,27.17 U3.9 31.05,29.45 32.12,30.53 35.92,30.53 37.12,31.73 37.12,35.6 38.92,37.4 61.8,37.4 63.14,38.74 IC1.6
  Bottom 0.305: v31.14,24.64 32,23.77 USB3.D-
DM4  (via drill 0.35)
  Top 0.305: v7.2,24.5 6.88,24.82 6.88,27 7.04,27.17 U4.9 7.04,29.45 8.12,30.53 11.92,30.53 13.12,31.73 13.12,35.1 15.42,37.4 37.3,37.4 38.5,38.6 61.4,38.6 61.86,39.06 IC1.4
  Bottom 0.305: v7.2,24.5 7.7,24 7.7,13.67 USB2.D-
DP1  (via drill 0.35)
  Top 0.305: v80,24.63 79.32,25.31 79.32,26.78 79.67,27.14 U1.8 79.67,29.27 80.3,29.9 84.2,29.9 85.7,31.4 85.7,36.9 85,37.6 67.3,37.6 66.34,38.56 IC1.11
  Bottom 0.305: USB5.D+ 82,13.5 80.6,14.9 80.6,24.03 v80,24.63
DP2  (via drill 0.35)
  Top 0.305: v55.9,24.64 55.34,25.2 55.34,26.79 55.7,27.15 U2.8 55.7,29.29 56.32,29.91 60.22,29.91 61.72,31.41 61.72,34.92 65.06,38.26 IC1.9
  Bottom 0.305: USB4.D+ 56.6,14.77 56.6,23.94 v55.9,24.64
DP3  (via drill 0.35)
  Top 0.305: v32.1,24.64 31.34,25.4 31.34,26.81 31.7,27.17 U3.8 31.7,29.3 32.32,29.93 36.22,29.93 37.72,31.43 37.72,35.4 39.12,36.8 62,36.8 63.78,38.58 IC1.7
  Bottom 0.305: USB3.D+ 32.46,14.91 32.46,24.28 v32.1,24.64
DP4  (via drill 0.35)
  Top 0.305: v8.2,24.5 7.34,25.36 7.34,26.81 7.7,27.17 U4.8 7.7,29.3 8.32,29.93 12.22,29.93 13.72,31.43 13.72,34.8 15.72,36.8 37.5,36.8 38.7,38 61.6,38 62.5,38.9 IC1.5
  Bottom 0.305: USB2.D+ 8.2,15.17 v8.2,24.5
GND  (via drill 0.35)  (147 unrouted)
  Top 0.305: SD1.S4 87.25,14.75 v87,15 | SD1.S3 73.54,13.54 v73.5,13.5 | SD1.6 78.2,16.8 v78,17 | SD2.S4 63.27,14.76 v63.02,15.01 | SD2.S3 49.56,13.55 v49.52,13.51 | SD2.6 54.22,16.81 v54.02,17.01 | SD4.S1 17.52,5.28 | SD4.S4 15.27,14.78 v15.02,15.03 | SD4.S3 1.56,13.57 v1.52,13.53 | SD4.6 6.22,16.83 v6.02,17.03 | R5.2 v73,44
  other vias: 62.5,51.5 68.5,51.5 72.5,57.5 62,57.5 51.5,57.5 43.5,45.5 45.5,45.5 44.5,47 44.5,44 2.5,42.5 12.5,50 13.5,39 21,31 21,19 9,3 33,4 57,4.5 81,4.5 68.5,4 45,4 21.5,4 87.5,5 98,2 90.5,25 46.5,47 46.5,44 47.5,45.5 42.5,47 41.5,45.5 42.5,44 40.5,47 40.5,44 41.5,48.5 43.5,48.5 45.5,48.5 47.5,48.5 47.5,42.5 45.5,42.5 43.5,42.5 41.5,42.5 40.5,41 42.5,41 44.5,41 46.5,41 46.5,50 44.5,50 42.5,50 40.5,50 91,31 91,19.5 89.5,5 73.5,5 65.5,4.5 49.5,4.5 41.5,4.5 25.5,4.5 17.5,4.5 1.5,4.5
N$1
  Top 0.305: IC1.14 70.88,43.7 R5.1
N$2
  Top 0.305: U1.4 82.28,25.93 83.6,24.6 86.9,24.6 88.5,26.2 Y1.2 89.96,27.54 91,26.5 92.9,26.5 C7.2
N$3
  Top 0.305: U2.4 58.3,25.93 59.62,24.61 62.92,24.61 64.52,26.21 Y2.2 65.98,27.55 67.02,26.51 68.92,26.51 C10.2
N$4
  Top 0.305: U2.5 57.65,25.68 59.32,24.01 62.98,24.01 Y2.1 66.48,22.47 67.52,23.51 68.92,23.51 C12.2
N$5
  Top 0.305: U1.5 81.62,25.68 83.3,24 86.96,24 Y1.1 90.46,22.46 91.5,23.5 92.9,23.5 C8.2
N$6  (via drill 0.35)
  Top 0.305: v69.5,1.32 70.18,2 PORT2.C 70.5,3.14 v71,3.64 | v19.8,3 19.5,2.7 PORT4.A | R19.2 77.9,41.8 78.5,41.2 89.3,41.2 90.6,39.9 94.2,39.9 94.6,39.5 94.6,8.6 v96.2,7
  Bottom 0.305: v69.5,1.32 69.28,1.52 68.88,1.52 68.18,1.52 67.66,2.04 51.51,2.04 51.37,2.19 48.44,2.19 47.98,1.73 47.42,1.73 46.51,2.64 44.01,2.64 43.78,2.42 43.18,2.42 42.5,3.1 37.48,3.1 37.36,2.99 27.88,2.99 27.76,3.1 19.9,3.1 v19.8,3 | v71,3.64 71.64,3 75.81,3 75.86,2.96 89.31,2.96 89.91,3.56 93.86,3.56 96.2,5.89 v96.2,7
N$7
  Top 0.305: IC1.2 60.58,44.92 60,45.5 55.5,45.5 54,44 XL1.2
N$8
  Top 0.305: IC1.12 66.98,44.92 66.6,45.3 64,45.3 61.6,47.7 60.4,47.7 59.94,48.16 IC1.28 59.94,49.96 C38.1 C35.1
N$9
  Top 0.305: IC1.3 61.22,45.18 60.3,46.1 55.61,46.1 XL1.1
N$10
  Top 0.305: R6.2 82,31.1 79.9,31.1 78.38,29.57 U1.10
N$11
  Top 0.305: R8.2 58.02,31.11 55.92,31.11 54.4,29.59 U2.10
N$12
  Top 0.305: U2.13 52.45,30.43 53.52,31.51 C15.1
N$13
  Top 0.305: IC1.18 66.34,50.04 66.7,50.4 68.8,50.4 69.1,50.1 69.1,49.4 70.4,48.1 72.02,48.1 R1.2 74.1,50.18 R4.1
N$14
  Top 0.305: R10.1 69.02,7.51 D1.A
N$15
  Top 0.305: U2.14 51.8,30.43 50.52,31.71 R11.1
N$16
  Top 0.305: U3.4 34.3,25.95 35.62,24.63 38.92,24.63 40.52,26.23 Y3.2 41.98,27.57 43.02,26.53 44.92,26.53 C21.2
N$17
  Top 0.305: U3.5 33.65,25.7 35.32,24.03 38.98,24.03 Y3.1 42.48,22.49 43.52,23.53 44.92,23.53 C22.2
N$18
  Top 0.305: R12.2 34.02,31.13 31.92,31.13 30.39,29.61 U3.10
N$19
  Top 0.305: U3.13 28.45,30.45 29.52,31.53 C23.1
N$20  (via drill 0.35)
  Top 0.305: PORT1.C v94.5,3.1 | v43.5,3.1 PORT3.A | R18.2 82.28,41.8 89.6,41.8 90.9,40.5 94.4,40.5 95.2,39.7 95.2,9 v96.2,8
  Bottom 0.305: v43.5,3.1 51.74,3.1 51.88,2.97 61.36,2.97 61.4,3 69.14,3 69.65,2.5 89.5,2.5 90.1,3.1 v94.5,3.1 94.73,3.33 94.73,3.77 97,6.05 97,7.5 96.5,8 v96.2,8
N$21
  Top 0.305: U1.13 76.42,30.43 77.5,31.5 C9.1
N$22
  Top 0.508: PORT5.C 77.92,56.1 R3.2
N$23
  Top 0.305: IC1.23 63.14,47.76 64.5,46.4 68.9,46.4 69.3,46 75.7,46 76.5,46.8 80.12,46.8 R18.1
N$24
  Top 0.305: IC1.24 62.5,47.6 64.2,45.9 68.6,45.9 69,45.5 77.82,45.5 R19.1
N$25  (via drill 0.35)
  Top 0.305: PORT1.A 90.7,2 v90.4,2.3 | v68.6,2.2 68.4,2 PORT2.A | v47.7,2.42 46.92,2.42 PORT3.C 46.46,1.96 v45.5,1.96 | v21.5,2.4 21.9,2 PORT4.C | IC1.22 63.8,48 64.94,46.86 69.24,46.86 69.6,46.5 74.9,46.5 v75.6,47.2 75.8,47.4 84.9,47.4 91.2,41.1 94.6,41.1 95.8,39.9 95.8,9.8 v96.8,8.8 | v75.6,49.4 76.1,49.4 76.3,49.2 81.2,49.2 82.8,50.8 82.8,51.8 PORT5.A
  Bottom 0.305: 68.9,2.5 v68.6,2.2 | 68.9,2.5 51.7,2.5 51.55,2.64 47.93,2.64 v47.7,2.42 | v45.5,1.96 45.27,2.19 44.2,2.19 43.97,1.96 42.99,1.96 42.31,2.64 37.67,2.64 37.55,2.53 27.69,2.53 27.57,2.64 21.74,2.64 v21.5,2.4 | 68.9,2.5 69.36,2.04 89.69,2.04 89.95,2.3 v90.4,2.3 90.74,2.64 93.49,2.64 94.22,1.92 94.78,1.92 95.18,2.32 95.18,3.58 97.6,6 97.6,8 v96.8,8.8 | v75.6,47.2 v75.6,49.4
N$26
  Top 0.305: R7.1 93,7.5 D2.A
N$27
  Top 0.305: R13.1 45.02,7.53 D3.A
N$28
  Top 0.305: U1.14 75.78,30.43 74.5,31.7 R9.1
N$29
  Top 0.305: U3.14 27.8,30.45 26.52,31.73 R14.1
N$30
  Top 0.305: U4.4 10.29,25.95 11.62,24.63 14.92,24.63 16.52,26.23 Y4.2 17.98,27.57 19.02,26.53 20.92,26.53 C28.2
N$31
  Top 0.305: U4.5 9.64,25.7 11.32,24.03 14.98,24.03 Y4.1 18.48,22.49 19.52,23.53 20.92,23.53 C29.2
N$32
  Top 0.305: R15.2 10.02,31.13 7.92,31.13 6.39,29.61 U4.10
N$33
  Top 0.305: U4.13 4.45,30.45 5.52,31.53 C30.1
N$34
  Top 0.305: R16.1 21.02,7.53 D4.A
N$35
  Top 0.305: U4.14 3.79,30.45 2.52,31.73 R17.1
N$36
  pour Top (no thermals): 36.8,46.5 32.8,46.5 28.2,51.1 24.5,51.1 24.5,55.1 24.9,55.5 26.3,55.5 27,56.2 27,57.8 27.3,58.1 29.3,58.1 29.4,58 30,57.4 30,55 30,51.9 34.2,47.7 36.8,47.7
N$37
  Top 0.305: R27.2 46.35,52.85 EXTPWR.A
VM  (via drill 0.35)
  Top 0.508: 36,49 35.8,48.8 IC4.1
  Top 1.27: C3.+ 14.68,58 6.83,58 X5.2 5,54.17 5,53.76 4.3,53.07 4.3,50.83 5,50.14 5,47.7 CN1.PWR | v36,50 36,49
  Bottom 1.27: C3.+ 17.72,58 34,58 36,56 v36,50

### Text on the board
tPlace: - | + | PWR | ACT | SS34 | 1K | 104 | 330 | 10U | 10U | 104 | 104 | 10U | 100K | D+ | D- | 5V | GND | + | + | 330 | 47K | FE1.1 | 2K7 | 330 | 330 | EXTPWR | J1 | LM2596-S05 | 12Mhz | 10K | 104 | 104 | 104 | 104 | 10K | 104 | 104 | 104 | 104 | 10K | 104 | 104 | 104 | 104 | 10K | 104 | 104 | 104 | 104 | 715R | 715R | 715R | 715R | 20pF | 20pF | 20pF | 20pF | GL827 | GL827 | GL827 | GL827 | 20pF | 20pF | 20pF | 20pF | 12Mhz | 12Mhz | 12Mhz | 12Mhz | 104 | 104 | 104 | 104 | 10K | 10K | 10K | 10K | + | + | + | + | CARD | CARD | CARD | CARD | + | + | + | + | USB | USB | USB | USB
bPlace: D+ | D- | 5V | GND